# EasyEDA schematic SCH_NFC-Business-Card1_2025-01-03.json
TITLE: Sheet_1; REV: 1.0; Date: 2025-01-03; Sheet: 1/1; Drawn By: c1sc0; Company: Your Company
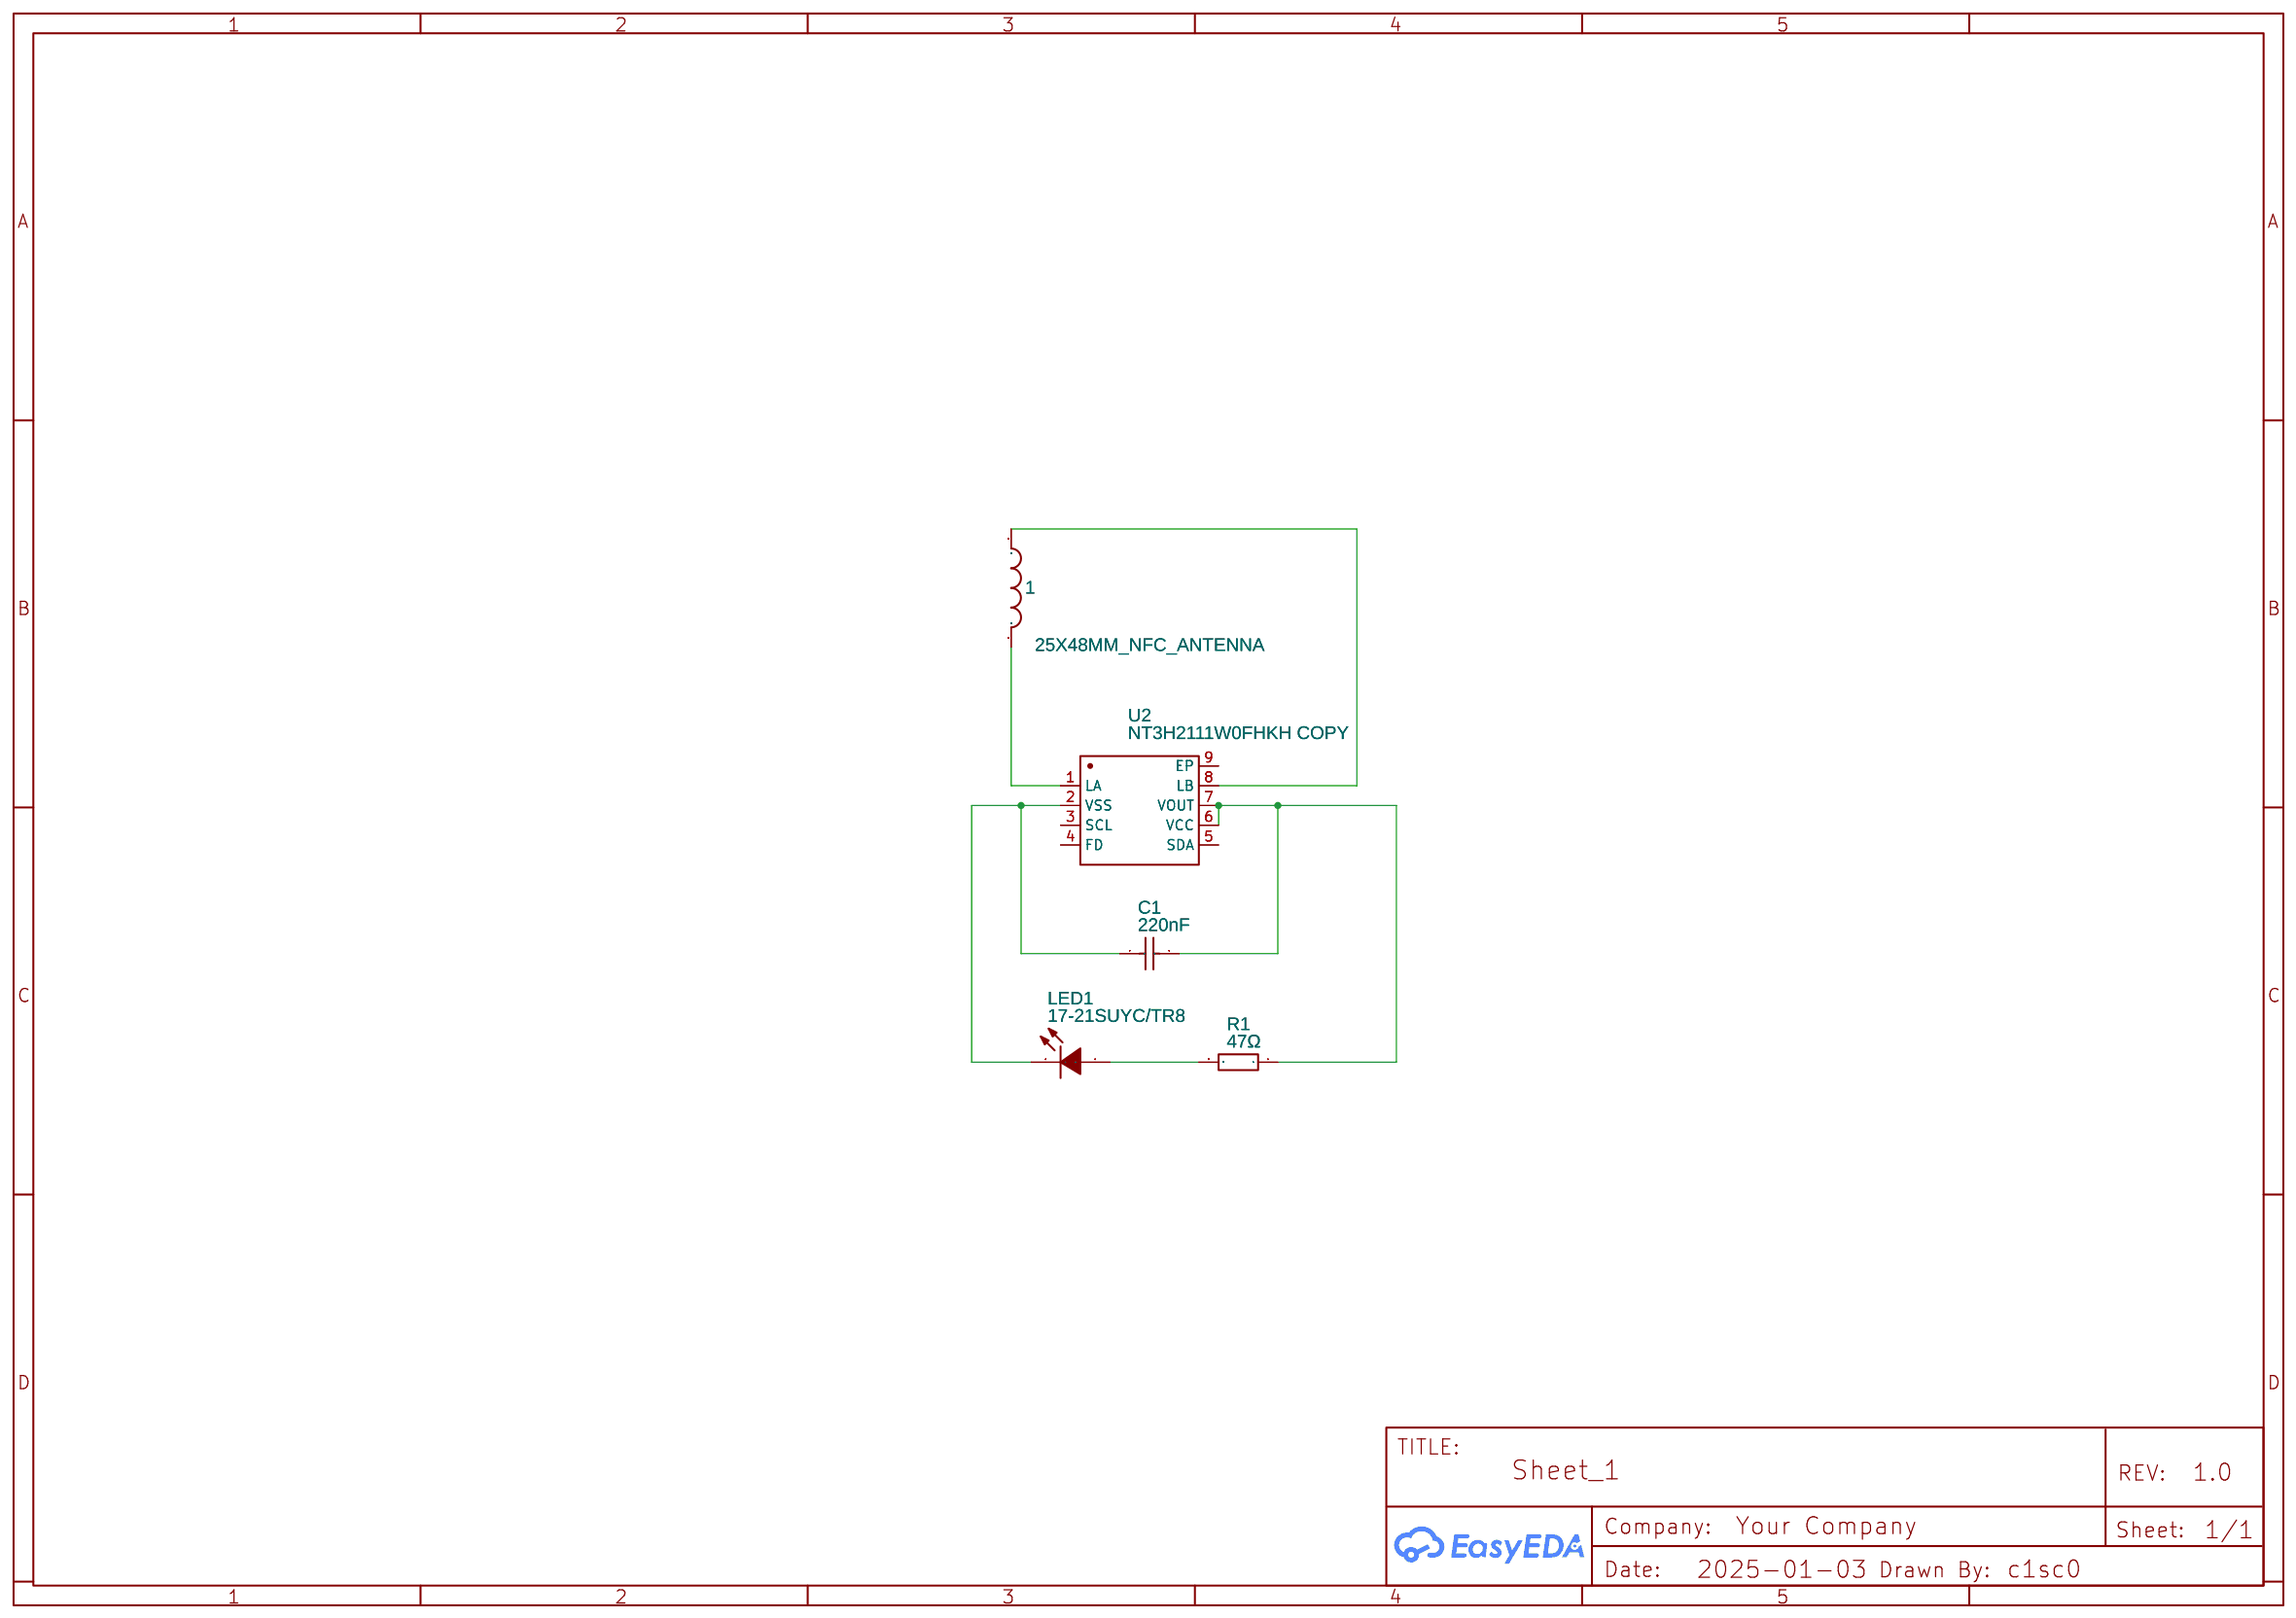
[diagram p0: schematic sheet]

## Parts
1  25X48MM_NFC_ANTENNA  [25X48MM_NFC]
C1  220nF  [C0603]
LED1  17-21SUYC/TR8  [LED0805-R-RD]
R1  47Ω  [R0603]
U2  NT3H2111W0FHKH COPY  [XQFN-8_L1.6-W1.6-P0.50-BL]

## Library data of the parts
1 = 25X48MM_NFC_ANTENNA: Contributor: barleybobs
C1 = CL10B224KA8NNNC: Supplier: LCSC; Manufacturer: SAMSUNG(三星); Supplier Part: C21120; JLCPCB Part Class: Basic Part
LED1 = 17-21SUYC/TR8: Supplier: LCSC; Manufacturer: KENTO; Manufacturer Part: KT-0805黄灯; Supplier Part: C2296; JLCPCB Part Class: Basic Part
R1 = 0603WAF470JT5E: Supplier: LCSC; Manufacturer: UNI-ROYAL(厚声); Supplier Part: C23182; JLCPCB Part Class: Basic Part
U2 = NT3H2111W0FHKH COPY: Contributor: LCSC; Supplier: LCSC; Supplier Part: C710403; Manufacturer: NXP(恩智浦); Manufacturer Part: NT3H2111W0FHKH; JLCPCB Part Class: Extended Part

## Nets
Net-(1-P$1): 1.P$1 U2.8(LB)
Net-(1-P$2): 1.P$2 U2.1(LA)
Net-(C1-1): C1.1 LED1.2(-) U2.2(VSS)
Net-(C1-2): C1.2 R1.1 U2.6(VCC) U2.7(VOUT)
Net-(LED1-1): LED1.1(+) R1.2

Not connected (* = marked no-connect by the designer): U2 3(SCL) 4(FD) 5(SDA) 9(EP)
